# Altium schematic sheet Reset Contador.SchDoc
size A4
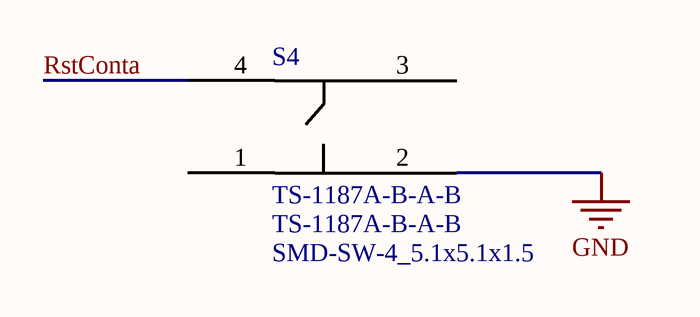
[diagram p0: Reset Contador.SchDoc]

## Parts
S4  TS-1187A-B-A-B  Package: SMD-SW-4_5.1x5.1x1.5  [TS-1187A-B-A-B]

## Nets
GND: S4.2
RstConta: S4.4

Not connected (* = marked no-connect by the designer): S4 1 3

## Library data of the parts
S4 = TS-1187A-B-A-B: MFR.Part #: TS-1187A-B-A-B